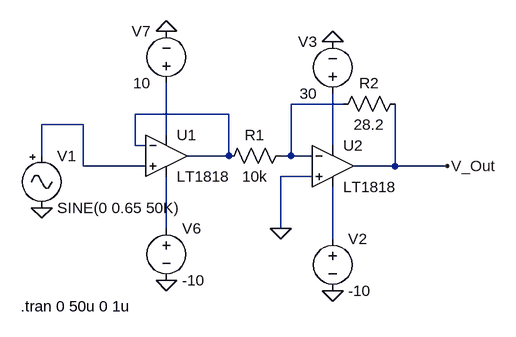
[diagram p0: schematic Practical_Single_Stage_Inverting_Amplifier_Schematic_with_Buffer_With_Actual_Parts.asc]
Practical_Single_Stage_Inverting_Amplifier_Schematic_with_Buffer_With_Actual_Parts.asc, the LTspice schematic file:
Version 4
SHEET 1 880 680
WIRE 160 80 80 80
WIRE -16 96 -160 96
WIRE -240 112 -304 112
WIRE -112 128 -112 48
WIRE -160 144 -160 96
WIRE -144 144 -160 144
WIRE 144 144 144 64
WIRE -304 160 -304 112
WIRE -16 160 -16 96
WIRE -16 160 -80 160
WIRE 80 160 80 80
WIRE 80 160 64 160
WIRE 112 160 80 160
WIRE -240 176 -240 112
WIRE -144 176 -240 176
WIRE 240 176 240 80
WIRE 240 176 176 176
WIRE 320 176 240 176
WIRE 112 192 64 192
WIRE -112 272 -112 192
WIRE 64 272 64 192
WIRE 144 288 144 208
FLAG -304 240 0
FLAG 144 368 0
FLAG 144 -16 0
FLAG 64 272 0
FLAG -112 352 0
FLAG -112 -32 0
FLAG 320 176 V_Out
SYMBOL res 80 144 R90
WINDOW 0 0 56 VBottom 2
WINDOW 3 32 56 VTop 2
SYMATTR InstName R1
SYMATTR Value 10k
SYMBOL res 256 64 R90
WINDOW 0 0 56 VBottom 2
WINDOW 3 32 56 VTop 2
SYMATTR InstName R2
SYMATTR Value 28.2
SYMBOL Misc\\signal -304 144 R0
WINDOW 123 0 0 Left 0
WINDOW 39 0 0 Left 0
SYMATTR InstName V1
SYMATTR Value SINE(0 0.65 50K)
SYMBOL voltage 144 272 R0
WINDOW 123 0 0 Left 0
WINDOW 39 0 0 Left 0
SYMATTR InstName V2
SYMATTR Value -10
SYMBOL voltage 144 80 R180
WINDOW 0 24 96 Left 2
WINDOW 3 24 16 Left 2
WINDOW 123 0 0 Left 0
WINDOW 39 0 0 Left 0
SYMATTR InstName V3
SYMATTR Value 30
SYMBOL voltage -112 256 R0
WINDOW 123 0 0 Left 0
WINDOW 39 0 0 Left 0
SYMATTR InstName V6
SYMATTR Value -10
SYMBOL voltage -112 64 R180
WINDOW 0 24 96 Left 2
WINDOW 3 24 16 Left 2
WINDOW 123 0 0 Left 0
WINDOW 39 0 0 Left 0
SYMATTR InstName V7
SYMATTR Value 10
SYMBOL OpAmps\\LT1818 -112 160 R0
SYMATTR InstName U1
SYMBOL OpAmps\\LT1818 144 176 R0
SYMATTR InstName U2
TEXT -336 392 Left 2 !.tran 0 50u 0 1u

The netlist it stands for:
* Practical_Single_Stage_Inverting_Amplifier_Schematic_with_Buffer_With_Actual_Parts.asc
R1 N001 N002 10k
R2 V_Out N001 28.2
V1 N003 0 SINE(0 0.65 50K)
V2 N007 0 -10
V3 N005 0 30
V6 N006 0 -10
V7 N004 0 10
XU1 N003 N002 N002 N004 N006 LT1818  ; pins In+ In- OUT V+ V-
XU2 0 N001 V_Out N005 N007 LT1818  ; pins In+ In- OUT V+ V-
.tran 0 50u 0 1u
.lib LTC2.lib
.backanno
.end